# Altium schematic sheet CRUVI.SchDoc: CR99400 - Connector
size A4; Organization: MicroFPGA UG(h); DocumentNumber: CR99400; Revision: 01; SheetNumber: 3; SheetTotal: 5; Date: 2022-05-16; CheckedBy: AL; Author: AL; CompanyName: MicroFPGA UG(h)
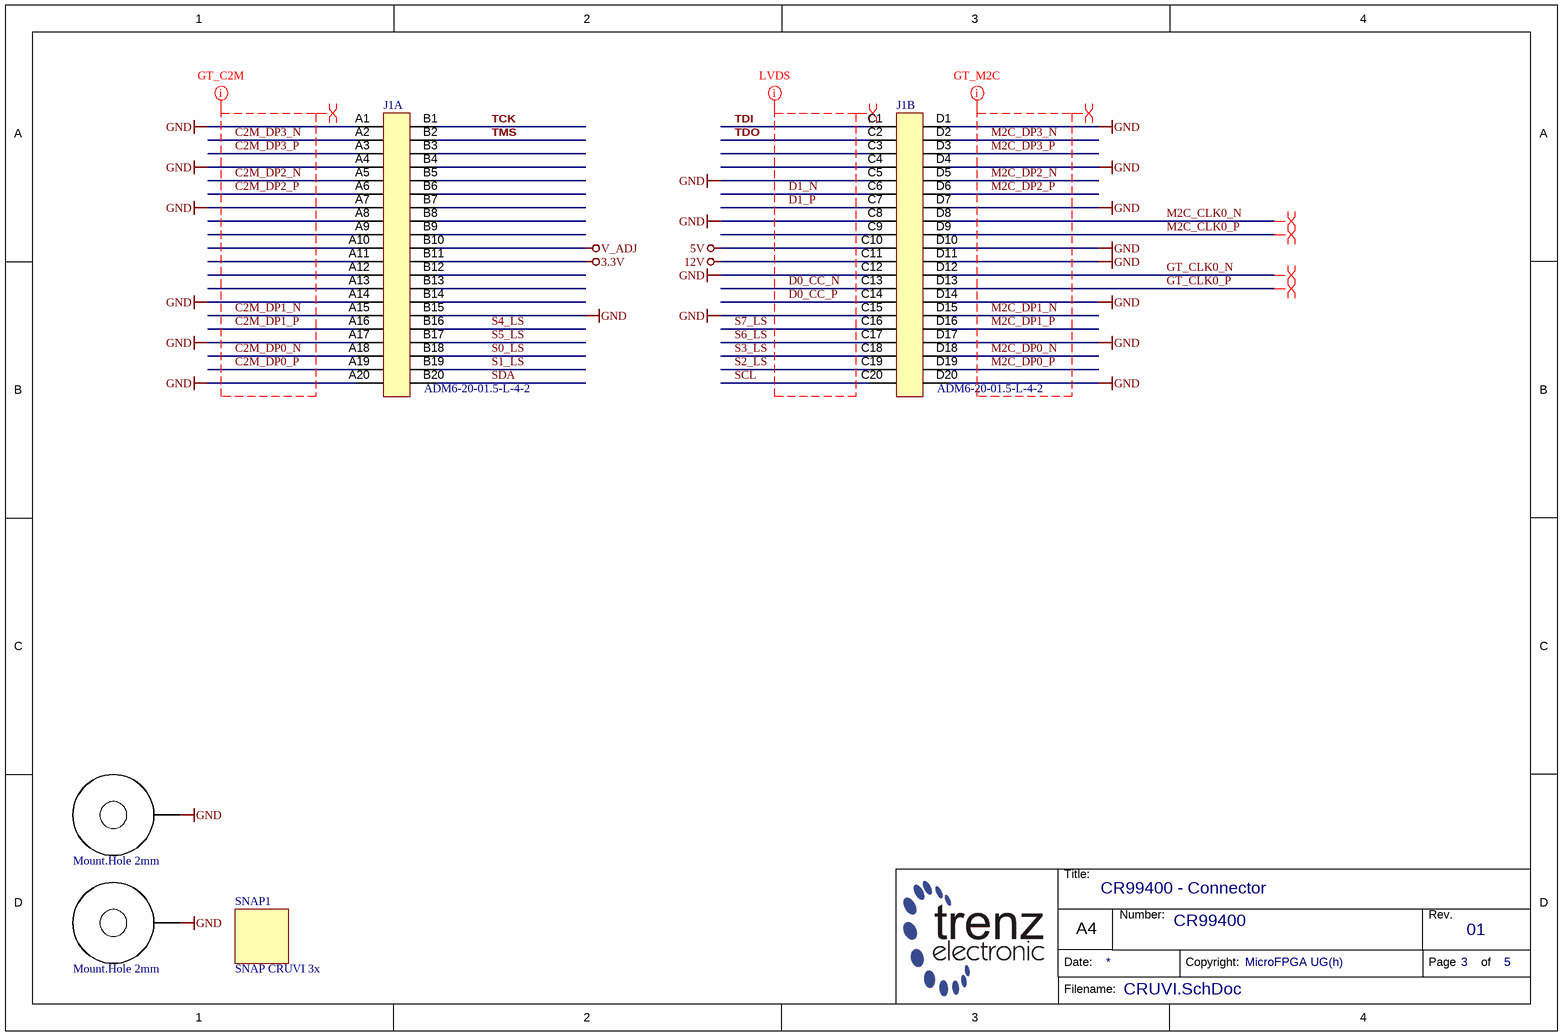
[diagram p0: CRUVI.SchDoc]

## Parts
H1  Mount.Hole 2mm  [MHole2_2mm]  (no BOM)
H2  Mount.Hole 2mm  [MHole2_2mm]  (no BOM)
J1  ADM6-20-01.5-L-4-2  [ADM6-20-01.5-L-4-2]  (parts A,B of 2)
SNAP1  SNAP CRUVI 3x  [CRUVI_3x_Snap]  (no BOM)

## Nets
3.3V: J1.B11
5V: J1.C10
12V: J1.C11
GND: H1.1 H2.1 J1.A1 J1.A4 J1.A7 J1.A14 J1.A17 J1.A20 J1.B15 J1.C5 J1.C8 J1.C12 J1.C15 J1.D1 J1.D4 J1.D7 J1.D10 J1.D11 J1.D14 J1.D17 J1.D20
V_ADJ: J1.B10
C2M_DP0_N: J1.A18
C2M_DP0_P: J1.A19
C2M_DP1_N: J1.A15
C2M_DP1_P: J1.A16
C2M_DP2_N: J1.A5
C2M_DP2_P: J1.A6
C2M_DP3_N: J1.A2
C2M_DP3_P: J1.A3
D0_CC_N: J1.C13
D0_CC_P: J1.C14
D1_N: J1.C6
D1_P: J1.C7
GT_CLK0_N: J1.D12
GT_CLK0_P: J1.D13
M2C_CLK0_N: J1.D8
M2C_CLK0_P: J1.D9
M2C_DP0_N: J1.D18
M2C_DP0_P: J1.D19
M2C_DP1_N: J1.D15
M2C_DP1_P: J1.D16
M2C_DP2_N: J1.D5
M2C_DP2_P: J1.D6
M2C_DP3_N: J1.D2
M2C_DP3_P: J1.D3
S0_LS: J1.B18
S1_LS: J1.B19
S2_LS: J1.C19
S3_LS: J1.C18
S4_LS: J1.B16
S5_LS: J1.B17
S6_LS: J1.C17
S7_LS: J1.C16
SCL: J1.C20
SDA: J1.B20
TCK: J1.B1
TDI: J1.C1
TDO: J1.C2
TMS: J1.B2

Not connected (* = marked no-connect by the designer): J1 A8 A9 A10 A11 A12 A13 B3 B4 B5 B6 B7 B8 B9 B12 B13 B14 C3 C4 C9

## Layout directives
differential pair: C2M_DP0_N, C2M_DP0_P, C2M_DP1_N, C2M_DP1_P, C2M_DP2_N, C2M_DP2_P, C2M_DP3_N, C2M_DP3_P, D0_CC_N, D0_CC_P, D1_N, D1_P, GT_CLK0_N, GT_CLK0_P, M2C_CLK0_N, M2C_CLK0_P, M2C_DP0_N, M2C_DP0_P, M2C_DP1_N, M2C_DP1_P, M2C_DP2_N, M2C_DP2_P, M2C_DP3_N, M2C_DP3_P
net class GT_C2M: C2M_DP0_N, C2M_DP0_P, C2M_DP1_N, C2M_DP1_P, C2M_DP2_N, C2M_DP2_P, C2M_DP3_N, C2M_DP3_P
net class LVDS: D0_CC_N, D0_CC_P, D1_N, D1_P
net class GT_M2C: M2C_DP0_N, M2C_DP0_P, M2C_DP1_N, M2C_DP1_P, M2C_DP2_N, M2C_DP2_P, M2C_DP3_N, M2C_DP3_P

## Notes on the sheet
- Title:
- Number:
- Rev.
- Date:
- A4
- Copyright:
- Page
- of
- Filename:

## Library data of the parts
H1 H2 = 27273: Mounting Hole 2mm Plated (Custom); AN: 27273; Mixed: THT
J1 = 33965: AN: 33965; Mixed: SMT; Temperature-Range: -55/+125; Extra: Samtec 0.635 mm AcceleRate® HD High-Density 4-Row 80 pin Header; Voltage: 155 VAC; Value: 1.4 A; HelpURL: b:\AD\adlib\datasheet\Samtec_ADM\; H-ART: ADM6-20-01.5-L-4-2
SNAP1 = 29977: SNAP for CRUVI 3x; AN: 29977